# EasyEDA schematic SCH_qrist0pf_Proj3_LED_2023-04-06.json
TITLE: qrist0pf Proj3 (LED); REV: 1.0; Date: 2023-03-30; Sheet: 1/1; Drawn By: olesiaserba; Company: www.fiverr.com/olesiaserba
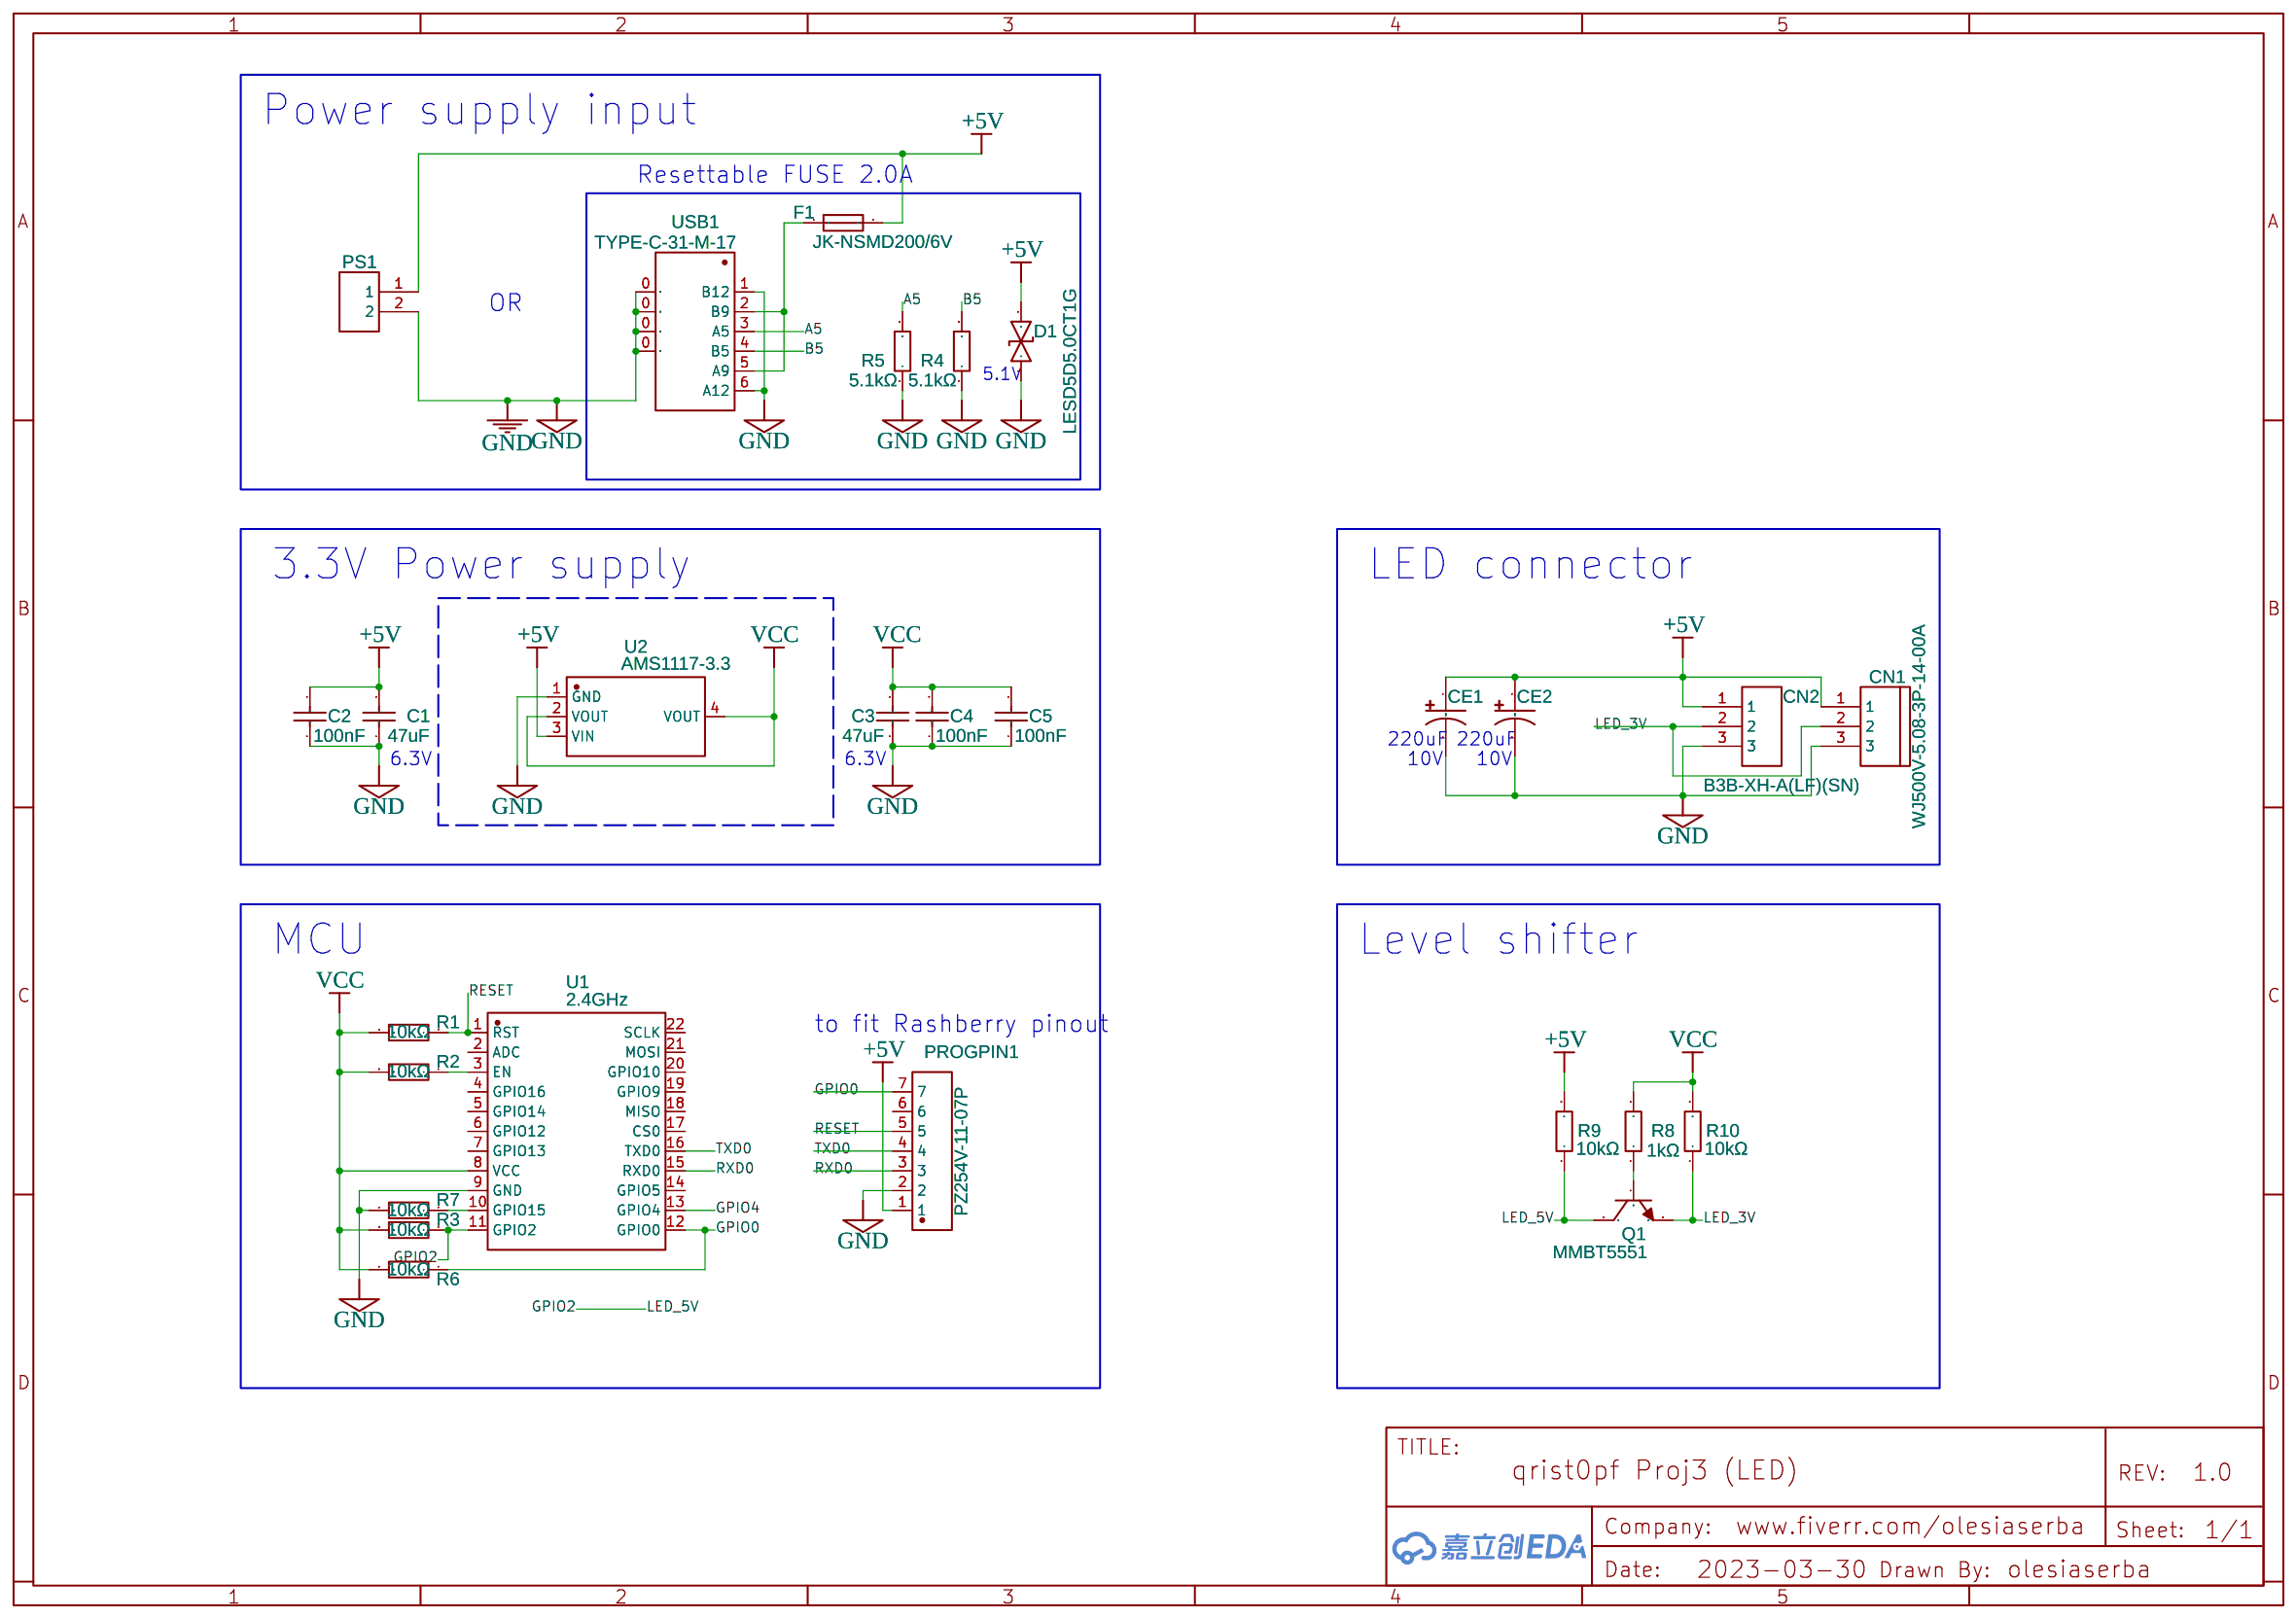
[diagram p0: schematic sheet]

## Parts
C1  47uF  [C0805]
C2  100nF  [C0805]
C3  47uF  [C0805]
C4  100nF  [C0805]
C5  100nF  [C0805]
CE1  220uF  [CAP-SMD_BD6.3-L6.6-W6.6-LS7.2-FD]
CE2  220uF  [CAP-SMD_BD6.3-L6.6-W6.6-LS7.2-FD]
CN1  WJ500V-5.08-3P-14-00A  [CONN-TH_3P-P5.00_WJ500V-5.08-3P]
CN2  B3B-XH-A(LF)(SN)  [CONN-TH_3P-P2.50_B3B-XH-A-LF-SN]
D1  LESD5D5.0CT1G  [SOD-523_L1.2-W0.8-LS1.6-BI]
F1  JK-NSMD200/6V  [F1206]
PROGPIN1  PZ254V-11-07P  [HDR-TH_7P-P2.54-V-M]
PS1  WJ500V-5.08-2P-14-00A  [CONN-TH_2P-P5.00_WJ500V-5.08-2P]
Q1  MMBT5551  [SOT-23-3_L2.9-W1.3-P1.90-LS2.4-BR]
R1  10kΩ  [R0402]
R2  10kΩ  [R0402]
R3  10kΩ  [R0402]
R4  5.1kΩ  [R0603]
R5  5.1kΩ  [R0603]
R6  10kΩ  [R0402]
R7  10kΩ  [R0402]
R8  1kΩ  [R0402]
R9  10kΩ  [R0402]
R10  10kΩ  [R0402]
U1  2.4GHz  [WIFIM-SMD_ESP-12F-ESP8266MOD]
U2  AMS1117-3.3  [SOT-223-3_L6.5-W3.4-P2.30-LS7.0-BR]
USB1  TYPE-C-31-M-17  [USB-C-SMD_10P-P1.00-L6.8-W8.9]

## Library data of the parts
C1 C3 = CL21A476MQYNNNE: Supplier: LCSC; Manufacturer: SAMSUNG(三星); Supplier Part: C16780; JLCPCB Part Class: Basic Part
C2 C4 C5 = CC0805KRX7R9BB104: Supplier: LCSC; Manufacturer: YAGEO; Supplier Part: C49678; JLCPCB Part Class: Basic Part
CE1 CE2 = RVT1A221M0607_C87859: Supplier: LCSC; Manufacturer: HONOR; Manufacturer Part: RVT1A221M0607; Supplier Part: C87859; JLCPCB Part Class: Extended Part
CN1 = WJ500V-5.08-3P-14-00A: Supplier: LCSC; Manufacturer: KANGNEX(康奈克斯电气); Manufacturer Part: WJ500V-5.08-3P; Supplier Part: C72334; JLCPCB Part Class: Extended Part
CN2 = B3B-XH-A(LF)(SN): Supplier: LCSC; Supplier Part: C144394; Manufacturer: JST Sales America; Contributor: LCSC; JLCPCB Part Class: Extended Part
D1 = LESD5D5.0CT1G: Supplier: LCSC; Supplier Part: C383211; Manufacturer: Leshan Radio; Contributor: LCSC; JLCPCB Part Class: Extended Part
F1 = JK-NSMD200/6V: Supplier: LCSC; Supplier Part: C2830251; Manufacturer: JK(金科); Manufacturer Part: JK-nSMD200/6V; JLCPCB Part Class: Extended Part; Contributor: LCSC
PROGPIN1 = PZ254V-11-07P: Supplier: LCSC; Supplier Part: C492406; Manufacturer: XFCN(兴飞); Contributor: LCSC; JLCPCB Part Class: Extended Part
PS1 = WJ500V-5.08-2P-14-00A: Supplier: LCSC; Manufacturer: ReliaPro; Supplier Part: C8465; JLCPCB Part Class: Extended Part
Q1 = MMBT5551_C2145: Supplier: LCSC; Manufacturer: CJ; Supplier Part: C2145; JLCPCB Part Class: Basic Part
R1-R3 R6 R7 = 0402WGF1002TCE: Supplier: LCSC; Manufacturer: UNI-ROYAL(厚声); Supplier Part: C25744; Resistance (Ohms): 10K; JLCPCB Part Class: Basic Part
R4 R5 = 0603WAF5101T5E: Supplier: LCSC; Manufacturer: UNI-ROYAL(厚声); Supplier Part: C23186; Resistance (Ohms): 5.1K; JLCPCB Part Class: Basic Part
R8 = 0402WGF1001TCE: Supplier: LCSC; Manufacturer: UniOhm; Supplier Part: C11702; Resistance (Ohms): 1K; JLCPCB Part Class: Basic Part
R9 R10 = 0402WGF1002TCE: Supplier: LCSC; Manufacturer: UniOhm; Supplier Part: C25744; Resistance (Ohms): 10K; JLCPCB Part Class: Basic Part
U1 = ESP-12F(ESP8266MOD): Supplier: LCSC; Manufacturer: Ai-Thinker(安信可); Supplier Part: C82891; JLCPCB Part Class: Extended Part
U2 = AMS1117-3.3: sourceId: dwIGgezVh; Supplier: LCSC; Manufacturer: AMS; Supplier Part: C6186; JLCPCB Part Class: Basic Part
USB1 = TYPE-C-31-M-17: Supplier: LCSC; Supplier Part: C283540; Manufacturer: 韩国韩荣; Contributor: LCSC; JLCPCB Part Class: Extended Part

## Nets
+5V: C1.2 C2.2 CE1.1 CE2.1 CN1.1 CN2.1 D1.2 F1.2 PROGPIN1.1 PS1.1 R9.2 U2.3(VIN)
GND: C1.1 C2.1 C3.1 C4.1 C5.1 CE1.2 CE2.2 CN1.3 CN2.3 D1.1 PROGPIN1.2 PS1.2 R4.1 R5.1 R7.2 U1.9(GND) U2.1(GND) USB1.0 USB1.1(B12) USB1.6(A12)
VCC: C3.2 C4.2 C5.2 R1.2 R2.2 R3.2 R6.2 R8.2 R10.2 U1.8(VCC) U2.2(VOUT) U2.4(VOUT)
A5: R5.2 USB1.3(A5)
B5: R4.2 USB1.4(B5)
GPIO0: PROGPIN1.7 R6.1 U1.12(GPIO0)
GPIO2: Q1.3(C) R3.1 R9.1 U1.11(GPIO2)
GPIO4: U1.13(GPIO4)
LED_3V: CN1.2 CN2.2 Q1.2(E) R10.1
RESET: PROGPIN1.5 R1.1 U1.1(RST)
RXD0: PROGPIN1.3 U1.15(RXD0)
TXD0: PROGPIN1.4 U1.16(TXD0)
Net-(F1-1): F1.1 USB1.2(B9) USB1.5(A9)
Net-(Q1-1): Q1.1(B) R8.1
Net-(R2-1): R2.1 U1.3(EN)
Net-(R7-1): R7.1 U1.10(GPIO15)

Not connected (* = marked no-connect by the designer): PROGPIN1 6; U1 2(ADC) 4(GPIO16) 5(GPIO14) 6(GPIO12) 7(GPIO13) 14(GPIO5) 17(CS0) 18(MISO) 19(GPIO9) 20(GPIO10) 21(MOSI) 22(SCLK)

## Notes on the sheet
- Power supply input
- Resettable FUSE 2.0A
- OR
- 5.1V
- 3.3V Power supply
- LED connector
- 220uF
- 220uF
- 6.3V
- 6.3V
- 10V
- 10V
- MCU
- Level shifter
- to fit Rashberry pinout
